# Altium project USB2RTMI.PrjPcb
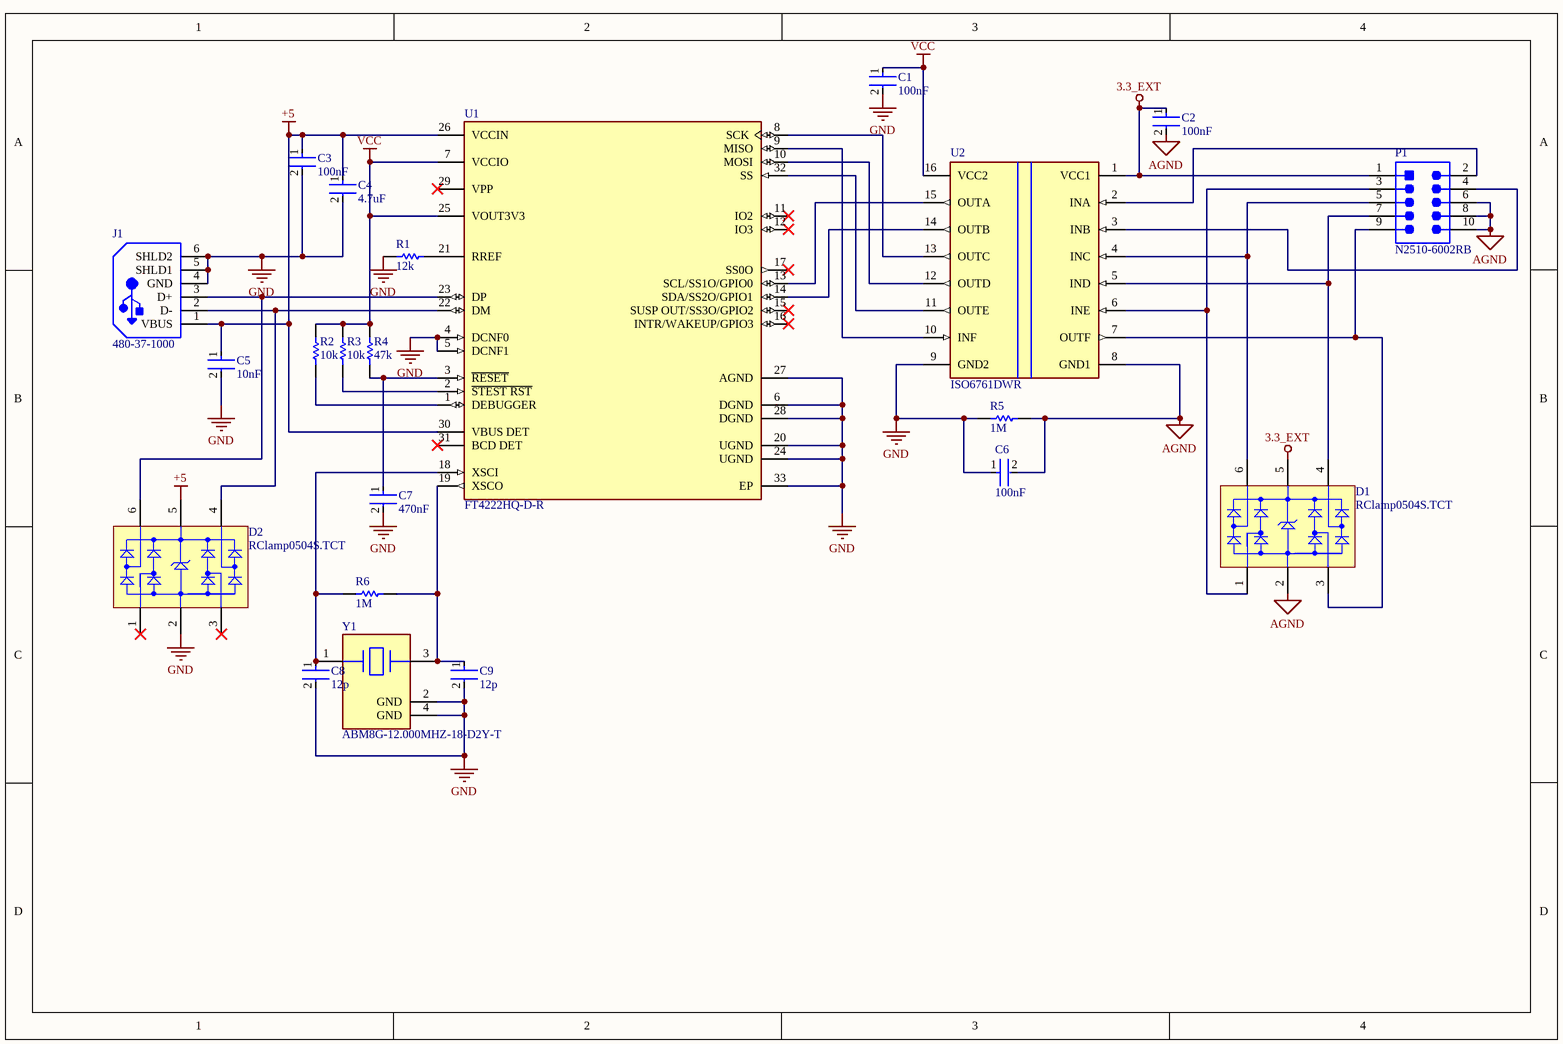
[diagram p0: USB-2-RTMI.SchDoc]
1 sheet, 22 parts. Net scope: global (net labels, ports and power ports of the same name join across sheets).
Board files: PCB_panelized.PcbDoc, USB-2-RTMI.PcbDoc

## Sheet USB-2-RTMI.SchDoc
size A4; SheetNumber: 1; SheetTotal: 1

### Parts
C1  100nF  [FP-C0805C-DN-MFG]
C2  100nF  [FP-C0805C-DN-MFG]
C3  100nF  [FP-C0805C-DN-MFG]
C4  4.7uF  [FP-C0805C-DN-MFG]
C5  10nF  [FP-C0805C-DN-MFG]
C6  100nF  [FP-C0805C-DN-MFG]
C7  470nF  [FP-C0805C-DN-MFG]
C8  12p  [FP-C0805C-DN-MFG]
C9  12p  [FP-C0805C-DN-MFG]
D1  RClamp0504S.TCT  [SEMT-SOT-23-6_V]
D2  RClamp0504S.TCT  [SEMT-SOT-23-6_V]
J1  480-37-1000  [MOLX-480-37-1000_V]
P1  N2510-6002RB  [3M-N2510-6002-10_V]
R1  12k  [RESC2013X60X35NL10T20]
R2  10k  [RESC2013X60X35NL10T20]
R3  10k  [RESC2013X60X35NL10T20]
R4  47k  [RESC2013X60X35NL10T20]
R5  1M  [RESC2013X60X35NL10T20]
R6  1M  [RESC2013X60X35NL10T20]
U1  FT4222HQ-D-R  [FP-VQFN-32-MFG]
U2  ISO6761DWR  [FP-DW0016A-IPC_B]
Y1  ABM8G-12.000MHZ-18-D2Y-T  [FP-ABM8G-MFG]

### Nets
3.3_EXT: C2.1 D1.5(VCC/NC) P1.1 U2.1(VCC1)
+5: C3.1 C4.1 C5.1 D2.5(VCC/NC) J1.1(VBUS) U1.26(VCCIN) U1.30(VBUS_DET)
AGND: C2.2 C6.2 D1.2(GND) P1.6 P1.8 P1.10 R5.2 U2.8(GND1)
GND: C1.2 C3.2 C4.2 C5.2 C6.1 C7.2 C8.2 C9.2 D2.2(GND) J1.4(GND) J1.5(SHLD1) J1.6(SHLD2) R1.1 R5.1 U1.4(DCNF0) U1.5(DCNF1) U1.6(DGND) U1.20(UGND) U1.24(UGND) U1.27(AGND) U1.28(DGND) U1.33(EP) U2.9(GND2) Y1.2(GND) Y1.4(GND)
VCC: C1.1 R2.2 R3.2 R4.2 U1.7(VCCIO) U1.25(VOUT3V3) U2.16(VCC2)
NetC7_1: C7.1 R4.1 U1.3(~{RESET})
NetC8_1: C8.1 R6.1 U1.18(XSCI) Y1.1
NetC9_1: C9.1 R6.2 U1.19(XSCO) Y1.3
NetD1_1: D1.1(I/O_1) P1.3 U2.6(INE)
NetD1_3: D1.3(I/O_3) P1.9 U2.7(OUTF)
NetD1_4: D1.4(I/O_4) P1.7 U2.5(IND)
NetD1_6: D1.6(I/O_2) P1.5 U2.4(INC)
NetD2_4: D2.4(I/O_4) J1.2(D-) U1.22(DM)
NetD2_6: D2.6(I/O_2) J1.3(D+) U1.23(DP)
NetP1_2: P1.2 U2.2(INA)
NetP1_4: P1.4 U2.3(INB)
NetR1_2: R1.2 U1.21(RREF)
NetR2_1: R2.1 U1.1(DEBUGGER)
NetR3_1: R3.1 U1.2(~{STEST_RST})
NetU1_8: U1.8(SCK) U2.13(OUTC)
NetU1_9: U1.9(MISO) U2.10(INF)
NetU1_10: U1.10(MOSI) U2.12(OUTD)
NetU1_13: U1.13(SCL/SS1O/GPIO0) U2.15(OUTA)
NetU1_14: U1.14(SDA/SS2O/GPIO1) U2.14(OUTB)
NetU1_32: U1.32(SS) U2.11(OUTE)

Not connected (* = marked no-connect by the designer): D2 1(I/O_1)* 3(I/O_3)*; U1 11(IO2)* 12(IO3)* 15(SUSP_OUT/SS3O/GPIO2)* 16(INTR/WAKEUP/GPIO3)* 17(SS0O)* 29(VPP)* 31(BCD_DET)*

### Library data of the parts
C1-C9 = CMP-2007-00279-2: CAP CER 0.1UF 50V X7R 0805; Manufacturer Part Number: C0805C104K5RACTU; Manufacturer: KEMET; Value: 0.10 μF; Tolerance: 0.1; Temperature Coefficient: 30ppm/°C; Material: Ceramic; Device Class L2: Capacitors; Temperature Range Low: -55°C; Voltage Rating: 50 V; Digikey Description: CAP CER 0.1UF 50V X7R 0805; Category: Cap; ComponentLink2Description: Datasheet; Octopart: https://octopart.com/c0805c104k5ractu-kemet-143926; RoHS: TRUE; ComponentLink2URL: https://content.kemet.com/datasheets/KEM_C1003_C0G_SMD.pdf; Temperature Characteristic: X7R; Temperature: -55°C to +125°C; Height: 0.88mm; Temperature Range High: +125°C; Device Class L1: Passive Components; Automotive: No; Lead Free: Yes; Ipc Land Pattern Name: CAPC200125X78; Device Class L3: Ceramic Capacitors; Mouser Description: Cap Ceramic 0.1uF 50V X7R 10% SMD 2.0 x 1.2 mm 125 C Paper T/R; Capacitance: 0.10 μF; Package: C0805C-DN
D1 D2 = CMP-2000-06976-1: RailClamp@ Low Capacitance TVS Array, 5 V VRWM, -55 to 125 degC, 6-Pin SOT-23, RoHS, Tape and Reel; Manufacturer: Semtech; Reverse Breakdown Voltage: 6V; Leakage Current (Max): 3uA; Product Depth (mm): 1.6mm; Rad Hardened: No; Clamping Voltage (Max): 25V; Product Length (mm): 2.9mm; Polarity: Uni-Directional; Working Voltage (Max): 5V; Product Height (mm): 1.15mm; Number of  Elements: 1; Peak Pulse Power Dissipation: 150W; Test Current (It): 1mA; Suppressor Type: DiodeArrays; Configuration: Quad; Capacitance Value: 3pF; Peak Pulse Current: 6A; Mounting Style: SurfaceMount; Manufacturer URL: http://www.semtech.com/; Package / Case: SOT-23; Mounting Technology: SurfaceMount; Operating Temperature Min Deg. C: -55C; Operating Temperature Max Deg. C: 125C; Leakage Current: 3uA; Direction Type: Uni-Directional; Pin Count: 6; Package Description: 6-Pin Small Outline Transistor, Body 2.95 x 1.625 mm, Pitch 0.95 mm; Working Voltage: 5V; Package Reference: SOT-23-6; Datasheet URL: http://www.semtech.com/images/datasheet/rclamp0504s.pdf; Mounting: SurfaceMount; Clamping Voltage: 25V; Datasheet Version: 01/2008; Operating Temperature Classification: Military; Packaging: TapeandReel; Reverse Stand-off Voltage: 5V; Operating Temp Range: -55Cto125C
J1 = CMP-1676-00005-1: Universal Serial Bus (USB) Shielded I/O Plug, Type A, Right Angle Connector, 1.5 A, -20 to 85 degC, 4-Pin SMD, RoHS, Tray; Tolerance: 1%; Power Rating: 100 mW; Voltage Rating: 50 V; Case\Package: 0603; Resistance: 1 mohm; Width: 0.8 mm; Mount: Surface Mount; ComponentLink1URL: http://www.molex.com/; ComponentLink1Description: Manufacturer URL; REACH SVHC: No SVHC; Case Code (Imperial): 0603; Height: 0.45 mm; Max Operating Temperature: 155 degC; ComponentLink2Description: Datasheet; Min Operating Temperature: -55 degC; Length: 1.6 mm; Pins: 2; RoHSCompliant: true; Package Quantity: 5000; DatasheetVersion: Rev. D, 06/2004; PackageDescription: 4-Pin Surface Mount Device, Body 12 x 18.8 mm; Voltage Rating (DC): 50 V; PackageReference: 480-37-1000; Case Code (Metric): 1608; ComponentLink2URL: http://www.molex.com/pdm_docs/sd/480371000_sd.pdf; Packaging: Tape and Reel
P1 = CMP-2000-06794-1: Male Header, Pitch 2.54 mm, 2 x 5 Postion, Height 9.91 mm, Tail Length 2.84 mm, -55 to 105 degC, RoHS, Bulk; PartNumber: N2510; Manufacturer: 3M; Package Version: Rev. M, 08/2014; Rad Hard: No; No. of Rows: 2; Number of Contacts: 10; Pitch: 2.54mm; Termination Method: Solder; Manufacturer URL: http://www.3m.com/; Package Description: 10-Pin Through Hole Device, Body 20.02 x 8.59 mm, Pitch 2.54 mm; Gender: Male; Number of Rows: 2; Orientation: Straight; Contact Plating: GoldOverNickel; Packaging: Rail/Tube; Mounting Technology: ThroughHole; Datasheet URL: https://datasheet.ciiva.com/11746/0900766b807b18da-11746957.pdf; Package Reference: N2510-6002-10; Datasheet Version: 05/2007; No. of Positions: 10; Package URL: http://multimedia.3m.com/mws/media/330367O/3mtm-100-in-4-wall-hdr-rohs-lp-straightra-hitemp-ts0770.pdf; Type: ShroudedHeader
R1-R6 = CMP-1659-00013-4: Chip Resistor, 10 KOhm, +/- 1%, 0.125 W, -55 to 155 degC, 0805 (2012 Metric), RoHS, Tape and Reel; Manufacturer: Yageo; Voltage Rating: 150 V; Mount: Surface Mount; ComponentLink1Description: Manufacturer URL; ComponentLink2URL: http://www.yageo.com/documents/recent/PYu-RC_Group_51_RoHS_L_04.pdf; Pins: 2; Length: 2 mm; Min Operating Temperature: -55 degC; Height: 0.5 mm; Mounting Technology: Surface Mount; RoHSCompliant: true; REACH SVHC: No SVHC; ComponentLink1URL: http://www.yageo.com/; Max Operating Temperature: 155 degC; PackageReference: 0805; DatasheetVersion: Rev. 4, 02/2016; Package Quantity: 5000; Packaging: Tape and Reel; ComponentLink2Description: Datasheet; PackageDescription: 2-Pin Surface Mounted Device, Body 2 x 1.25 mm
U1 = CMP-194822-000008-1: IC BRIDGE USB TO I2C/SPI 32VQFN; Interface: I2C; Operating Supply Current: 78mA; Case/Package: VQFN; Max Operating Temperature: 85°C; Min Operating Temperature: -40°C; Packaging: Tape and Reel
U2 = CMP-04872-000227-1: GENERAL PURPOSE, 50-MBPS, SIX-CH
Y1 = CMP-2000-05039-3: Crystal 12MHz ±20ppm (Tol) ±30ppm (Stability) 18pF FUND 120Ω 4-Pin SMD T/R; Series Resistance: 120R; Max Operating Temperature: 85°C; Mount: Surface Mount; Width: 2.5mm; Series: ABM8G; Termination: SMD/SMT; Frequency Tolerance: 20ppm; Tolerance: 20ppm; Min Operating Temperature: -40°C; Operating Frequency: 12 MHz; Depth: 2.5mm; Load Capacitance: 18pF; Number of Pins: 4; Length: 3.2mm; Radiation Hardening: No; Frequency Stability: 30ppm; Height: 1mm; Packaging: Tape and Reel; Package Quantity: 1000; ESR (Equivalent Series Resistance): 120R; Lead Free: Lead Free; Frequency: 12MHz; Case/Package: CSMD